# Altium schematic sheet CellMonitor.SchDoc: Cell Monitor
size A3; DrawnBy: Sam Haines; DocumentNumber: 5; Revision: 01; SheetNumber: 5; SheetTotal: 10; Version: 01; Project: Battery Managment System 2020; PageSetup: Record=PageOptions|CenterHorizontal=True|CenterVertical=True|PrintScale=0.97|XCorrection=1.00|YCorrection=1.00|PrintKind=0|BorderSize=5000000|LeftOffset=0|BottomOffset=0|Orientation=2|PaperLength=1000|PaperWidth=1000|Scale=100|PaperSource=7|PrintQuality=-4|MediaType=1|DitherType=10|PaperKind=A4|PrintScaleMode=1
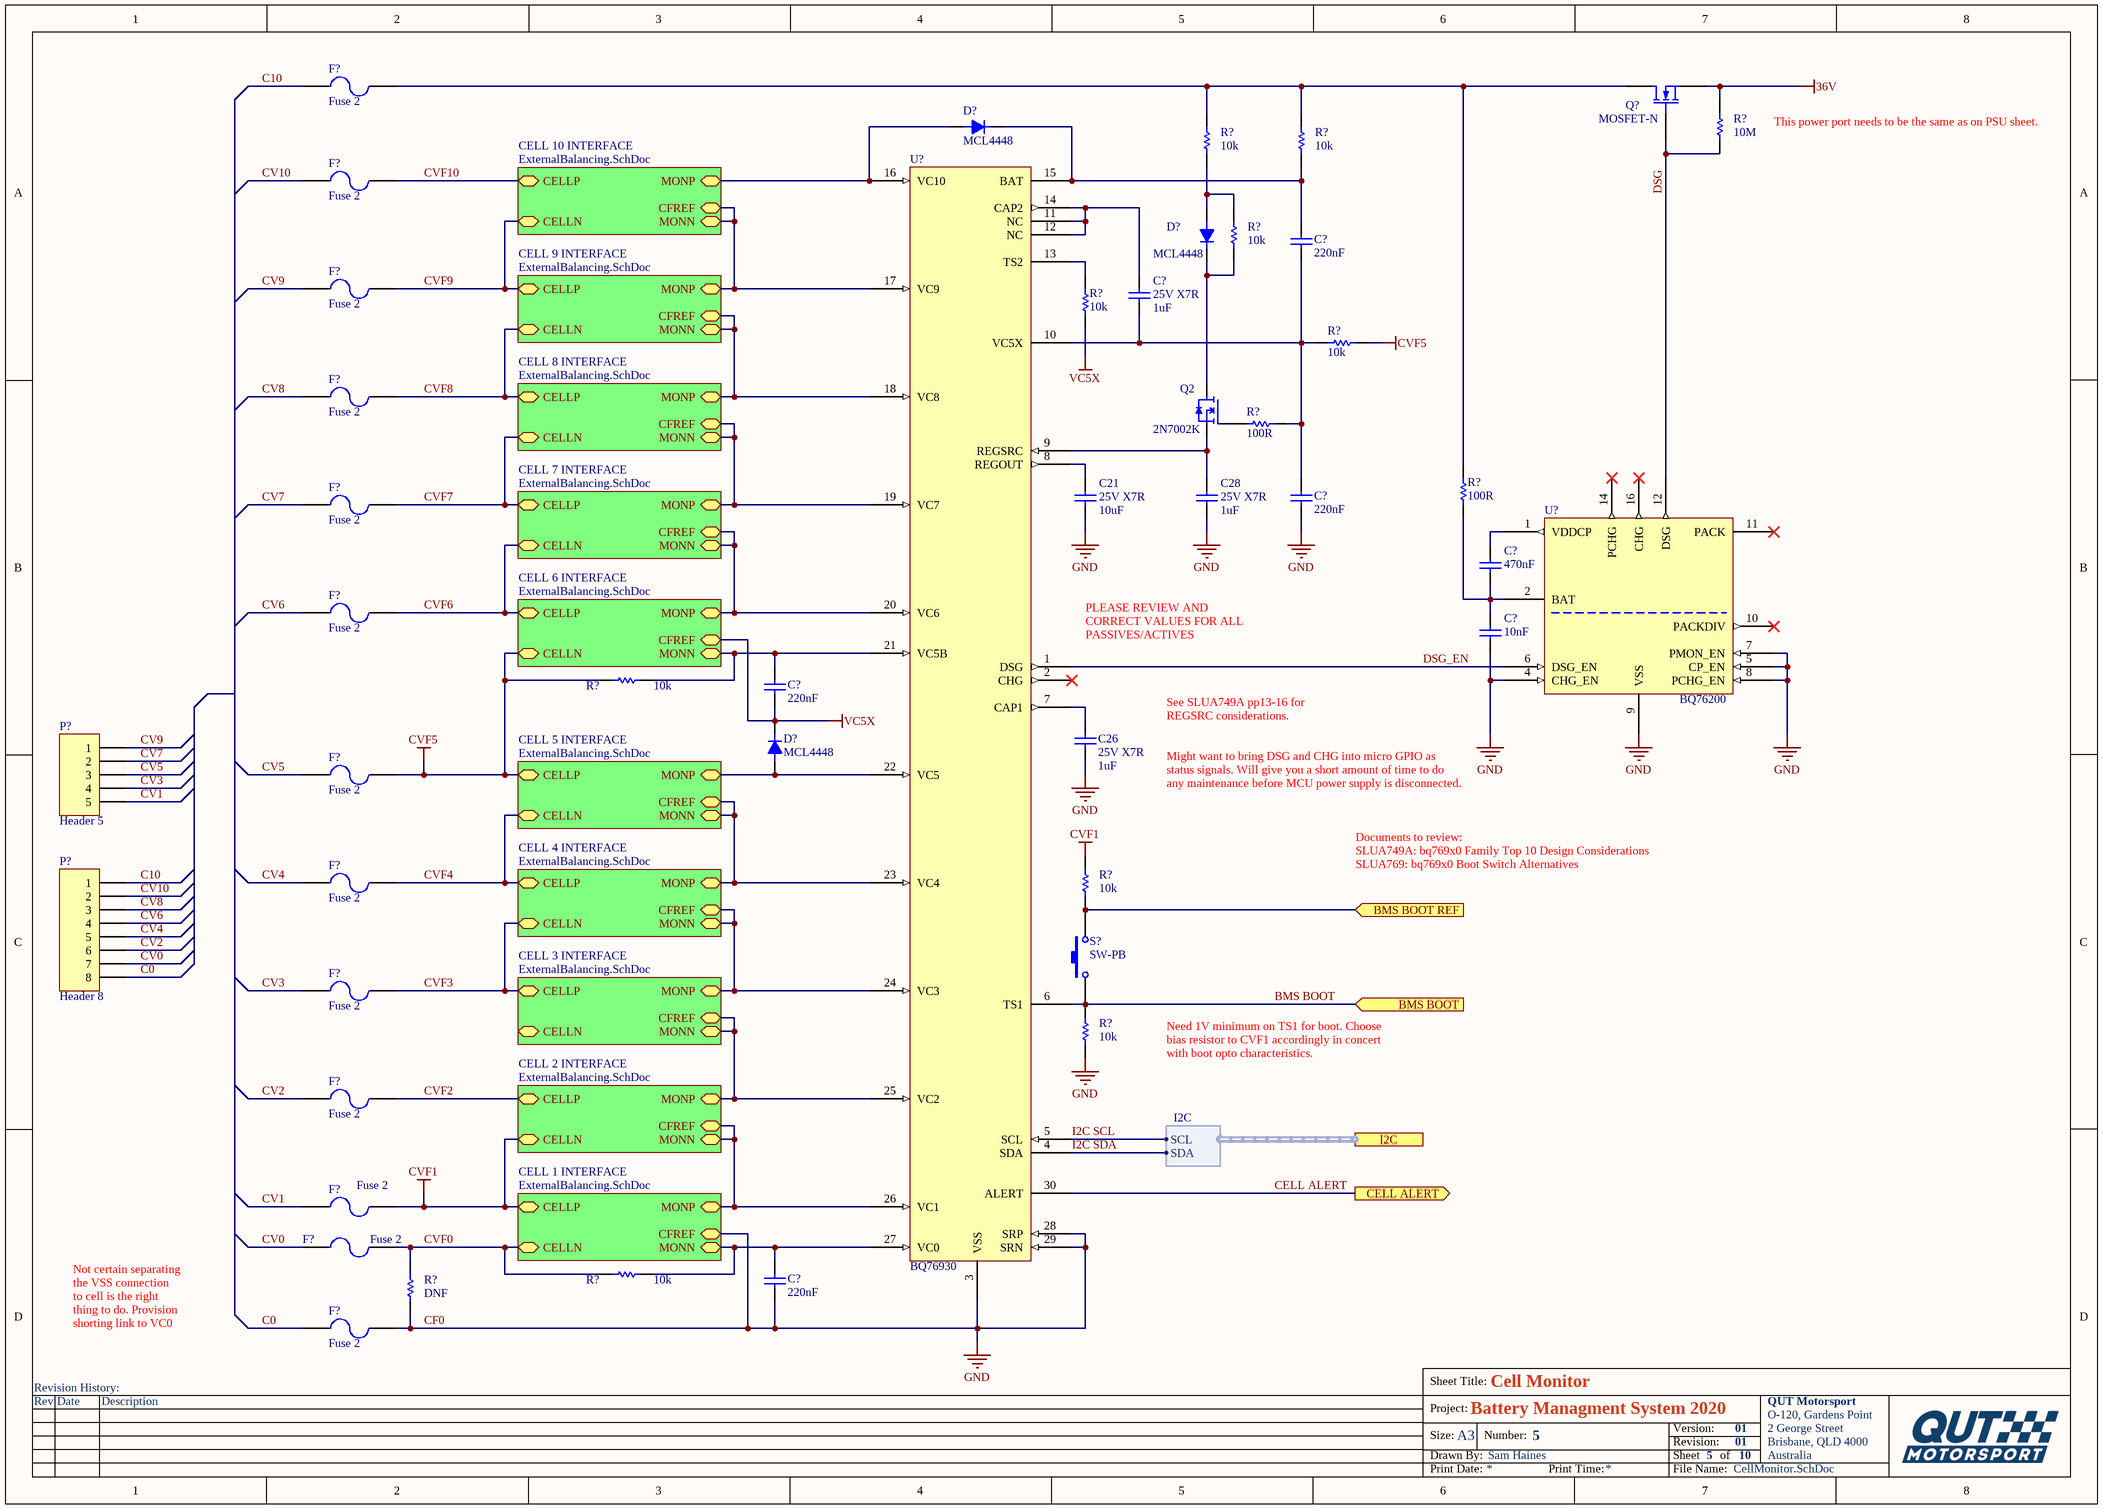
[diagram p0: CellMonitor.SchDoc]

## Parts
(Parts that share a designator on the sheet are numbered #1, #2 ... from top to bottom, then left to right.)
C21  25V X7R  value 10uF  [1206-CAP-1.8H]
C26  25V X7R  value 1uF  [0603-CAP-X7R-0.8H]
C28  25V X7R  value 1uF  [0603-CAP-X7R-0.8H]
C?#1  220nF  [CAPC2013X145X50ML20T25]
C?#2  25V X7R  value 1uF  [0603-CAP-X7R-0.8H]
C?#3  220nF  [CAPC2013X145X50ML20T25]
C?#4  470nF  [CAPC2013X145X50ML20T25]
C?#5  10nF  [CAPC2013X145X50ML20T25]
C?#6  220nF  [CAPC2013X145X50ML20T25]
C?#7  220nF  [CAPC2013X145X50ML20T25]
D?#1  MCL4448  [MICRO-MELF]
D?#2  MCL4448  [MICRO-MELF]
D?#3  MCL4448  [MICRO-MELF]
F?#1  Fuse 2  [PIN-W2/E2.8]
F?#2  Fuse 2  [PIN-W2/E2.8]
F?#3  Fuse 2  [PIN-W2/E2.8]
F?#4  Fuse 2  [PIN-W2/E2.8]
F?#5  Fuse 2  [PIN-W2/E2.8]
F?#6  Fuse 2  [PIN-W2/E2.8]
F?#7  Fuse 2  [PIN-W2/E2.8]
F?#8  Fuse 2  [PIN-W2/E2.8]
F?#9  Fuse 2  [PIN-W2/E2.8]
F?#10  Fuse 2  [PIN-W2/E2.8]
F?#11  Fuse 2  [PIN-W2/E2.8]
F?#12  Fuse 2  [PIN-W2/E2.8]
F?#13  Fuse 2  [PIN-W2/E2.8]
P?#1  Header 5  [HDR1X5]
P?#2  Header 8  [HDR1X8]
Q2  2N7002K  [SOT23-3-GDS]
Q?  MOSFET-N  [E3]
R?#1  value 10M  [0603-RES]  (hidden comment: Resistor, SMD 10k 1% 0603)
R?#2  value 10k  [0603-RES]  (hidden comment: Resistor, SMD 10k 1% 0603)
R?#3  value 10k  [0603-RES]  (hidden comment: Resistor, SMD 10k 1% 0603)
R?#4  value 10k  [0603-RES]  (hidden comment: Resistor, SMD 10k 1% 0603)
R?#5  value 10k  [0603-RES]  (hidden comment: Resistor, SMD 10k 1% 0603)
R?#6  value 10k  [0603-RES]  (hidden comment: Resistor, SMD 10k 1% 0603)
R?#7  value 100R  [0603-RES]  (hidden comment: Resistor, SMD 10k 1% 0603)
R?#8  value 100R  [0603-RES]  (hidden comment: Resistor, SMD 10k 1% 0603)
R?#9  value 10k  [0603-RES]  (hidden comment: Resistor, SMD 10k 1% 0603)
R?#10  value 10k  [0603-RES]  (hidden comment: Resistor, SMD 10k 1% 0603)
R?#11  value 10k  [0603-RES]  (hidden comment: Resistor, SMD 10k 1% 0603)
R?#12  value 10k  [0603-RES]  (hidden comment: Resistor, SMD 10k 1% 0603)
R?#13  value DNF  [0603-RES]  (hidden comment: Resistor, SMD 10k 1% 0603)
S?  SW-PB  [SPST-2]
U?#1  BQ76200  [TSSOP16]
U?#2  BQ76930  [TSSOP50P640X120-30N]

## Sub-sheets
CELL 1 INTERFACE = ExternalBalancing.SchDoc: CFREF (bidir), MONP (bidir), MONN (bidir), CELLP (bidir), CELLN (bidir)
CELL 2 INTERFACE = ExternalBalancing.SchDoc: CFREF (bidir), MONP (bidir), MONN (bidir), CELLP (bidir), CELLN (bidir)
CELL 3 INTERFACE = ExternalBalancing.SchDoc: CFREF (bidir), MONP (bidir), MONN (bidir), CELLP (bidir), CELLN (bidir)
CELL 4 INTERFACE = ExternalBalancing.SchDoc: CFREF (bidir), MONP (bidir), MONN (bidir), CELLP (bidir), CELLN (bidir)
CELL 5 INTERFACE = ExternalBalancing.SchDoc: CFREF (bidir), MONP (bidir), MONN (bidir), CELLP (bidir), CELLN (bidir)
CELL 6 INTERFACE = ExternalBalancing.SchDoc: CFREF (bidir), MONP (bidir), MONN (bidir), CELLP (bidir), CELLN (bidir)
CELL 7 INTERFACE = ExternalBalancing.SchDoc: CFREF (bidir), MONP (bidir), MONN (bidir), CELLP (bidir), CELLN (bidir)
CELL 8 INTERFACE = ExternalBalancing.SchDoc: CFREF (bidir), MONP (bidir), MONN (bidir), CELLP (bidir), CELLN (bidir)
CELL 9 INTERFACE = ExternalBalancing.SchDoc: CFREF (bidir), MONP (bidir), MONN (bidir), CELLP (bidir), CELLN (bidir)
CELL 10 INTERFACE = ExternalBalancing.SchDoc: CFREF (bidir), MONP (bidir), MONN (bidir), CELLP (bidir), CELLN (bidir)

## Ports
BMS BOOT (in), BMS BOOT REF (in), CELL ALERT (out), I2C (harness I2C)

## Harnesses
I2C: SDA, SCL

## Nets
36V: Q?.3(S) R?#1.1
CF0: C21.2 C26.2 C28.2 C?#3.1 C?#5.1 C?#7.1 F?#13.2 R?#11.2 R?#13.2 U?#1.4(CHG_EN) U?#1.5(CP_EN) U?#1.7(PMON_EN) U?#1.8(PCHG_EN) U?#1.9(VSS) U?#2.3(VSS) U?#2.28(SRP) U?#2.29(SRN) ; sheet CELL 1 INTERFACE/CFREF  [also labelled GND]
CVF1: F?#11.2 R?#10.1 ; sheet CELL 1 INTERFACE/CELLP, sheet CELL 2 INTERFACE/CELLN
CVF5: F?#7.2 R?#6.1 R?#9.1 ; sheet CELL 5 INTERFACE/CELLP, sheet CELL 6 INTERFACE/CELLN
VC5X: C?#6.1 D?#3.K R?#5.1 ; sheet CELL 6 INTERFACE/CFREF
BMS BOOT: R?#11.1 S?.1 U?#2.6(TS1) ; port BMS BOOT
BMS BOOT REF: R?#10.2 S?.2 ; port BMS BOOT REF
C0: F?#13.1 P?#2.8
C10: F?#1.1 P?#2.1
CELL ALERT: U?#2.30(ALERT) ; port CELL ALERT
CV0: F?#12.1 P?#2.7
CV1: F?#11.1 P?#1.5
CV2: F?#10.1 P?#2.6
CV3: F?#9.1 P?#1.4
CV4: F?#8.1 P?#2.5
CV5: F?#7.1 P?#1.3
CV6: F?#6.1 P?#2.4
CV7: F?#5.1 P?#1.2
CV8: F?#4.1 P?#2.3
CV9: F?#3.1 P?#1.1
CV10: F?#2.1 P?#2.2
CVF0: F?#12.2 R?#12.1 R?#13.1 ; sheet CELL 1 INTERFACE/CELLN
CVF2: F?#10.2 ; sheet CELL 2 INTERFACE/CELLP
CVF3: F?#9.2 ; sheet CELL 3 INTERFACE/CELLP, sheet CELL 4 INTERFACE/CELLN
CVF4: F?#8.2 ; sheet CELL 4 INTERFACE/CELLP, sheet CELL 5 INTERFACE/CELLN
CVF6: F?#6.2 ; sheet CELL 6 INTERFACE/CELLP, sheet CELL 7 INTERFACE/CELLN
CVF7: F?#5.2 ; sheet CELL 7 INTERFACE/CELLP, sheet CELL 8 INTERFACE/CELLN
CVF8: F?#4.2 ; sheet CELL 8 INTERFACE/CELLP, sheet CELL 9 INTERFACE/CELLN
CVF9: F?#3.2 ; sheet CELL 10 INTERFACE/CELLN, sheet CELL 9 INTERFACE/CELLP
CVF10: F?#2.2 ; sheet CELL 10 INTERFACE/CELLP
DSG: Q?.2(G) R?#1.2 U?#1.12(DSG)
DSG_EN: U?#1.6(DSG_EN) U?#2.1(DSG)
I2C SCL: U?#2.5(SCL) ; port I2C.SCL
I2C SDA: U?#2.4(SDA) ; port I2C.SDA
NetC21_1: C21.1 U?#2.8(REGOUT)
NetC26_1: C26.1 U?#2.7(CAP1)
NetC28_1: C28.1 Q2.S U?#2.9(REGSRC)
NetC?#1_1: C?#1.1 C?#2.2 C?#3.2 R?#6.2 R?#7.1 U?#2.10(VC5X)
NetC?#1_2: C?#1.2 D?#1.K R?#3.2 U?#2.15(BAT)
NetC?#2_1: C?#2.1 U?#2.11(NC) U?#2.12(NC) U?#2.14(CAP2)
NetC?#4_1: C?#4.1 C?#5.2 R?#8.2 U?#1.2(BAT)
NetC?#4_2: C?#4.2 U?#1.1(VDDCP)
NetC?#6_2: C?#6.2 R?#9.2 U?#2.21(VC5B) ; sheet CELL 6 INTERFACE/MONN
NetC?#7_2: C?#7.2 R?#12.2 U?#2.27(VC0) ; sheet CELL 1 INTERFACE/MONN
NetD?#1_A: D?#1.A U?#2.16(VC10) ; sheet CELL 10 INTERFACE/MONP
NetD?#2_A: D?#2.A R?#2.2 R?#4.1
NetD?#2_K: D?#2.K Q2.D R?#4.2
NetD?#3_A: D?#3.A U?#2.22(VC5) ; sheet CELL 5 INTERFACE/MONP
NetF?#1_2: F?#1.2 Q?.1(D) R?#2.1 R?#3.1 R?#8.1
NetQ2_G: Q2.G R?#7.2
NetR?#5_2: R?#5.2 U?#2.13(TS2)
NetU?#2_17: U?#2.17(VC9) ; sheet CELL 10 INTERFACE/CFREF, sheet CELL 10 INTERFACE/MONN, sheet CELL 9 INTERFACE/MONP
NetU?#2_18: U?#2.18(VC8) ; sheet CELL 8 INTERFACE/MONP, sheet CELL 9 INTERFACE/CFREF, sheet CELL 9 INTERFACE/MONN
NetU?#2_19: U?#2.19(VC7) ; sheet CELL 7 INTERFACE/MONP, sheet CELL 8 INTERFACE/CFREF, sheet CELL 8 INTERFACE/MONN
NetU?#2_20: U?#2.20(VC6) ; sheet CELL 6 INTERFACE/MONP, sheet CELL 7 INTERFACE/CFREF, sheet CELL 7 INTERFACE/MONN
NetU?#2_23: U?#2.23(VC4) ; sheet CELL 4 INTERFACE/MONP, sheet CELL 5 INTERFACE/CFREF, sheet CELL 5 INTERFACE/MONN
NetU?#2_24: U?#2.24(VC3) ; sheet CELL 3 INTERFACE/MONP, sheet CELL 4 INTERFACE/CFREF, sheet CELL 4 INTERFACE/MONN
NetU?#2_25: U?#2.25(VC2) ; sheet CELL 2 INTERFACE/MONP, sheet CELL 3 INTERFACE/CFREF, sheet CELL 3 INTERFACE/MONN
NetU?#2_26: U?#2.26(VC1) ; sheet CELL 1 INTERFACE/MONP, sheet CELL 2 INTERFACE/CFREF, sheet CELL 2 INTERFACE/MONN

Not connected (* = marked no-connect by the designer): U?#1 10(PACKDIV)* 11(PACK)* 14(PCHG)* 16(CHG)*; U?#2 2(CHG)*

## Notes on the sheet
- This power port needs to be the same as on PSU sheet.
- PLEASE REVIEW AND CORRECT VALUES FOR ALL PASSIVES/ACTIVES
- See SLUA749A pp13-16 for REGSRC considerations.
- Might want to bring DSG and CHG into micro GPIO as status signals. Will give you a short amount of time to do any maintenance before MCU power supply is disconnected.
- Documents to review:
  SLUA749A: bq769x0 Family Top 10 Design Considerations
  SLUA769: bq769x0 Boot Switch Alternatives
- Need 1V minimum on TS1 for boot. Choose bias resistor to CVF1 accordingly in concert with boot opto characteristics.
- Not certain separating the VSS connection to cell is the right thing to do. Provision shorting link to VC0
- Revision History:
- Sheet Title:
- Rev
- Date
- Description
- Project:
- Size:
- Drawn By:
- A3
- Number:
- Revision:
- Sheet
- Version:
- of
- QUT Motorsport
- O-120, Gardens Point
- 2 George Street
- Brisbane, QLD 4000
- Australia
- Print Date:
- Print Time:
- File Name:

## Library data of the parts
C21 = Capacitor, Ceramic SMD 10uF 25V 10% X7R 1206: Manufacturer: Generic; MPN: Capacitor, Ceramic SMD 10uF 25V 10% X7R 1206; Supplier 1: Mouser; Supplier Part Number 1: 810-C3216X7R1E106K
C26 C28 C?#2 = Capacitor, Ceramic SMD 1uF 25V 10% X7R 0603: Manufacturer: Generic; MPN: Capacitor, Ceramic SMD 1uF 25V 10% X7R 0603; Supplier 1: Mouser; Supplier Part Number 1: 80-C0603C105K3R
C?#1 C?#3-C?#7 = CMP-2007-01110-1: Part Number: C0805C224J5RACTU; Manufacturer: Kemet
D?#1-D?#3 = MCL4448-TR3: Diode, Silicon, 75V 150mA MicroMELF; Manufacturer: Vishay Semiconductor Diodes Division; MPN: MCL4448-TR3; Supplier 1: Mouser; Supplier Part Number 1: 78-MCL4448-TR3
F?#1-F?#13 = Fuse 2: Fuse; Published: 8-Jun-2000; LatestRevisionDate: 17-Jul-2002; LatestRevisionNote: Re-released for DXP Platform.; PackageReference: PIN-W2/E2.8; Publisher: Altium Limited; PackageDescription: Thru-Hole; 2 Leads
P?#1 = Header 5: Header, 5-Pin; LatestRevisionDate: 17-Jul-2002; LatestRevisionNote: Re-released for DXP Platform.; Publisher: Altium Limited
P?#2 = Header 8: Header, 8-Pin; LatestRevisionDate: 17-Jul-2002; LatestRevisionNote: Re-released for DXP Platform.; Publisher: Altium Limited
Q2 = 2N7002K-7: MOSFET, n-ch, 60V 380mA 2R, SOT23-3; Manufacturer: Diodes Incorporated; MPN: 2N7002K-7; Supplier 1: Mouser; Supplier Part Number 1: 621-2N7002K-7
Q? = MOSFET-N: N-Channel MOSFET; Published: 8-Jun-2000; LatestRevisionDate: 17-Jul-2002; LatestRevisionNote: Re-released for DXP Platform.; PackageVersion: 1995/1996; PackageReference: E3; Publisher: Altium Limited; PackageDescription: TO, Flat Index; 3 In-Line, Axial Leads; Body Dia. 4.6mm; Lead Dia. 0.5 mm (max)
R?#1-R?#13 = Resistor, SMD 10k 1% 0603: Manufacturer: Generic; MPN: Resistor, SMD 10k 1% 0603; Supplier 1: Mouser; Supplier Part Number 1: 603-RC0603FR-0710KL
S? = SW-PB: Switch; Published: 24-Mar-1999; LatestRevisionDate: 17-Jul-2002; LatestRevisionNote: Re-released for DXP Platform.; PackageReference: SPST-2; Publisher: Altium Limited; PackageDescription: Switch; 2 Leads
U?#1 = BQ76200PWR: High-voltage battery pack front-end charge/discharge high-side NFET driver; Manufacturer: Texas Instruments; MPN: BQ76200PWR
U?#2 = BQ76930: Battery Monitoring/Fuel Gauge Li-Ion/Li-Polymer/LiFePO4 0V to 16V 30-Pin TSSOP T/R; InternalPart: Test1234; Manufacturer: Texas Instruments; Manufacturer Part Number: BQ7693003DBTR; Operating Supply Voltage: 25V; Interface: I2C; Fault Protection: Over Current,Short Circuit,Over/Under Voltage; Supplier 1: Digi-Key; RoHS: Yes; Category: Battery Management; Stock 1: 4521; Pricing 1: 1=4.66000, 10=4.18900, 25=3.96000, 100=3.25600, 250=2.92160, 500=2.81600, 1000=2.34080 (USD); Mount: Surface Mount; Case/Package: TFSOP; Number of Pins: 30; Weight: 0.003439oz; Contact Plating: Gold; Min Operating Temperature: -40°C; Max Operating Temperature: 85°C; Output Voltage: 16V; Packaging: Tape and Reel; Package Quantity: 2000; Lead Free: Lead Free; ComponentLink1URL: http://www.ti.com/lit/gpn/bq76930?src-supplier=Mouser; ComponentLink1Description: http://www.ti.com/lit/gpn/bq76930?src-supplier=Mouser; ComponentLink2URL: http://www.ti.com/lit/ds/symlink/bq76930.pdf?src-supplier=Digi-Key; ComponentLink2Description: http://www.ti.com/lit/ds/symlink/bq76930.pdf?src-supplier=Digi-Key; ComponentLink3URL: http://www.ti.com/lit/pdf/slpt038?src-supplier=Digi-Key; ComponentLink3Description: http://www.ti.com/lit/pdf/slpt038?src-supplier=Digi-Key; ComponentLink4URL: http://www.ti.com/general/docs/lit/getliterature.tsp?genericPartNumber=BQ76920&amp;&amp;fileType=pdf&src-supplier=Avnet+Asia; ComponentLink4Description: http://www.ti.com/general/docs/lit/getliterature.tsp?genericPartNumber=BQ76920&amp;&amp;fileType=pdf&src-supplier=Avnet+Asia; ComponentLink5URL: http://www.ti.com/general/docs/lit/getliterature.tsp?genericPartNumber=BQ76920&&fileType=pdf&src-supplier=Avnet; ComponentLink5Description: http://www.ti.com/general/docs/lit/getliterature.tsp?genericPartNumber=BQ76920&&fileType=pdf&src-supplier=Avnet; Supplier Part Number 1: 296-39961-1-ND